# Altium schematic sheet REF_CPU_STM32_A.SchDoc
size A4; SheetNumber: 3; SheetTotal: 8
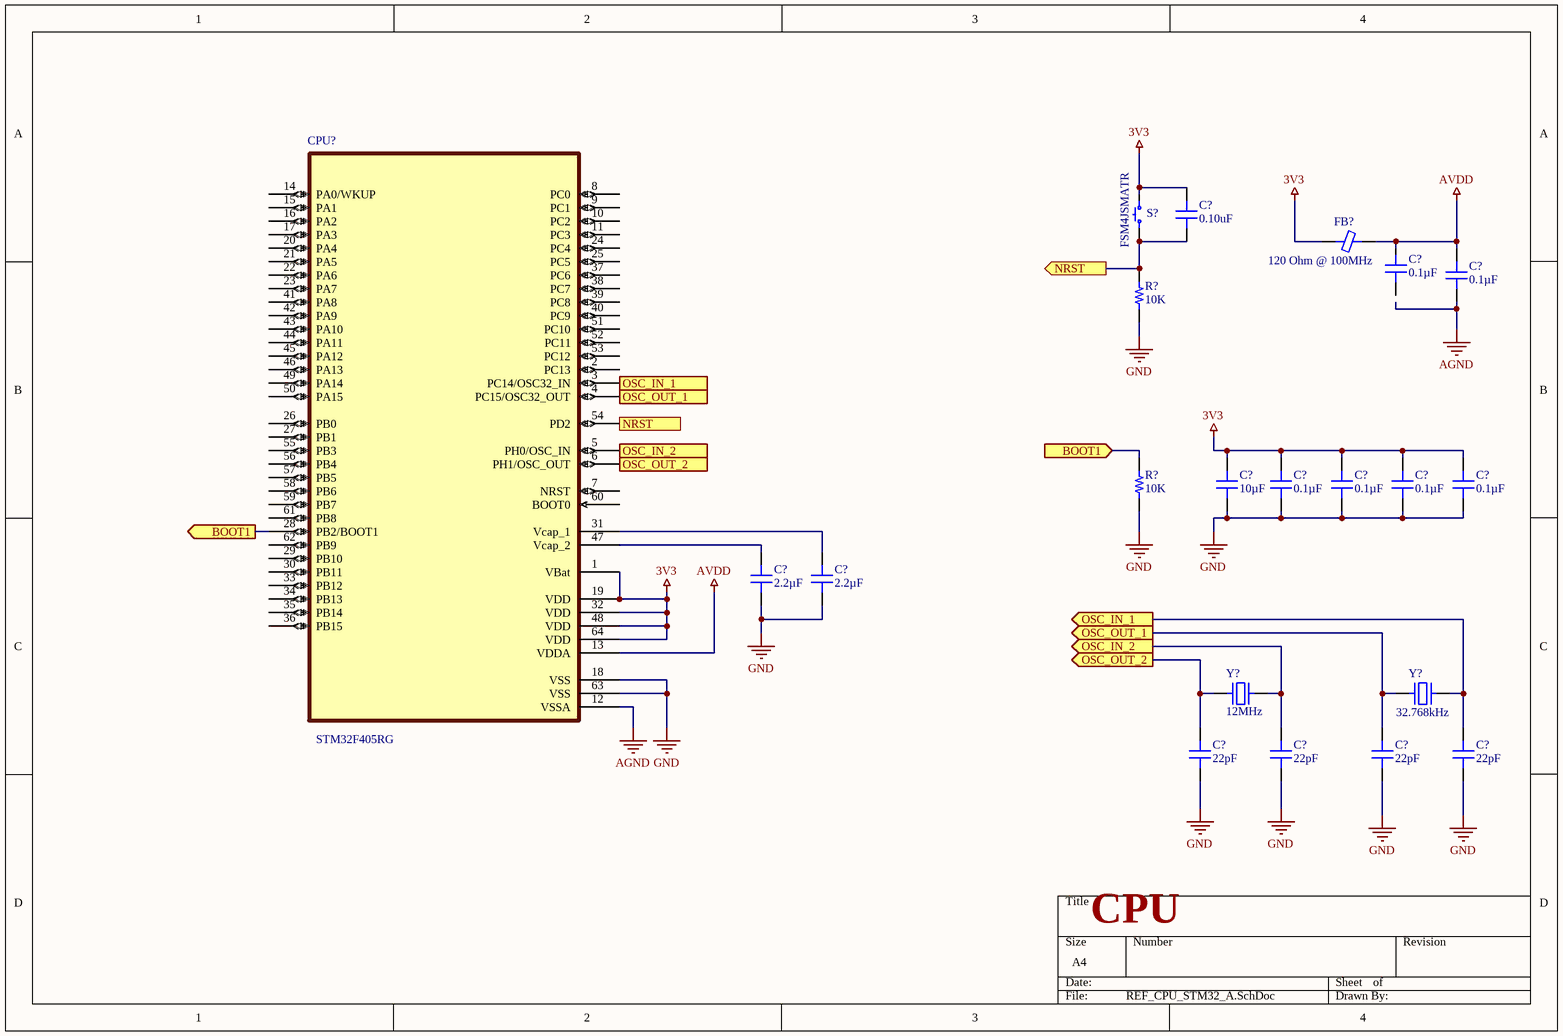
[diagram p0: REF_CPU_STM32_A.SchDoc]

## Parts
(Parts that share a designator on the sheet are numbered #1, #2 ... from top to bottom, then left to right.)
C?#1  0.10uF  [CAP 0603/1608]
C?#2  0.1µF  [CAP 0603_1608]
C?#3  0.1µF  [CAP 0603_1608]
C?#4  10µF  [CAP 0603_1608]
C?#5  0.1µF  [CAP 0603_1608]
C?#6  0.1µF  [CAP 0603_1608]
C?#7  0.1µF  [CAP 0603_1608]
C?#8  0.1µF  [CAP 0603_1608]
C?#9  2.2µF  [CAP 0603_1608]
C?#10  2.2µF  [CAP 0603_1608]
C?#11  22pF  [CAP 0402_1005]
C?#12  22pF  [CAP 0402_1005]
C?#13  22pF  [CAP 0402_1005]
C?#14  22pF  [CAP 0402_1005]
CPU?  STM32F405RG  [LQF64]
FB?  120 Ohm @ 100MHz  [FER 0805/2012]
R?#1  10K  [RES 0603/1608]
R?#2  10K  [RES 0603/1608]
S?  FSM4JSMATR  [TE FSM4JSMA]
Y?#1  12MHz  [ECS CSM-3X]
Y?#2  32.768kHz  [ABRACON ABS25]

## Ports
BOOT1 (in), BOOT1 (out), NRST (out), OSC_IN_1 (out), OSC_IN_2 (out), OSC_OUT_1 (out), OSC_OUT_2 (out)

## Nets
3V3: C?#1.2 C?#4.2 C?#5.2 C?#6.2 C?#7.2 C?#8.2 CPU?.1(VBat) CPU?.19(VDD) CPU?.32(VDD) CPU?.48(VDD) CPU?.64(VDD) FB?.1 S?.1 S?.2
AGND: C?#3.1 CPU?.12(VSSA)
AVDD: C?#2.2 C?#3.2 CPU?.13(VDDA) FB?.2
GND: C?#4.1 C?#5.1 C?#6.1 C?#7.1 C?#8.1 C?#9.1 C?#10.1 C?#11.1 C?#12.2 C?#13.1 C?#14.1 CPU?.18(VSS) CPU?.63(VSS) R?#1.1 R?#2.1
BOOT1: CPU?.28(PB2/BOOT1) R?#2.2 ; port BOOT1
NRST: C?#1.1 CPU?.54(PD2) R?#1.2 S?.3 S?.4 ; port NRST
OSC_IN_1: C?#14.2 CPU?.3(PC14/OSC32_IN) Y?#2.4 ; port OSC_IN_1
OSC_IN_2: C?#12.1 CPU?.5(PH0/OSC_IN) Y?#1.2 ; port OSC_IN_2
OSC_OUT_1: C?#13.2 CPU?.4(PC15/OSC32_OUT) Y?#2.1 ; port OSC_OUT_1
OSC_OUT_2: C?#11.2 CPU?.6(PH1/OSC_OUT) Y?#1.1 ; port OSC_OUT_2
NetC?#9_2: C?#9.2 CPU?.47(Vcap_2)
NetC?#10_2: C?#10.2 CPU?.31(Vcap_1)

Not connected (* = marked no-connect by the designer): C?#2 1; CPU? 2(PC13) 7(NRST) 8(PC0) 9(PC1) 10(PC2) 11(PC3) 14(PA0/WKUP) 15(PA1) 16(PA2) 17(PA3) 20(PA4) 21(PA5) 22(PA6) 23(PA7) 24(PC4) 25(PC5) 26(PB0) 27(PB1) 29(PB10) 30(PB11) 33(PB12) 34(PB13) 35(PB14) 36(PB15) 37(PC6) 38(PC7) 39(PC8) 40(PC9) 41(PA8) 42(PA9) 43(PA10) 44(PA11) 45(PA12) 46(PA13) 49(PA14) 50(PA15) 51(PC10) 52(PC11) 53(PC12) 55(PB3) 56(PB4) 57(PB5) 58(PB6) 59(PB7) 60(BOOT0) 61(PB8) 62(PB9)

## Notes on the sheet
- CPU

## Library data of the parts
C?#1 = CL10B104KB8NNNC: CAP CER 0.1UF 50V X7R 0603; Manufacturer: Samsung Electro-Mechanics America, Inc.; TemperatureRange: -55C ~ 125C; Tolerance: 10%; Value: 0.10uF; Part Number: CL10B104KB8NNNC; PartId: 12945; Supplier 1: Digi-Key; Supplier Part Number 1: 1276-1000-2-ND; ComponentLink1Description: Datasheet; ComponentLink1URL: http://www.samsungsem.com/kr/support/product-search/mlcc/CL10B104KB8NNNC.jsp; ComponentLink2Description: Digi-Key Listing; ComponentLink2URL: https://www.digikey.com/product-detail/en/samsung-electro-mechanics-america-inc/CL10B104KB8NNNC/1276-1000-2-ND/3886658; TemperatureCoefficient: X7R; Voltage: 50V; Price: 0.0052; Device Package: 0603 (1608 Metric)
C?#2 C?#3 C?#5-C?#8 = 06033C104JAT2A: CAP CER 0.1UF 25V X7R 0603; Manufacturer: AVX Corporation; Tolerance: ±5%; Part Number: 06033C104JAT2A; Value: 0.1µF; Applications: General Purpose; Capacitance: 0.1µF; ComponentLink1Description: Datasheet; ComponentLink1URL: http://datasheets.avx.com/X7RDielectric.pdf; ComponentLink2Description: DigiKey Link; ComponentLink2URL: http://digikey.com/product-detail/en/avx-corporation/06033C104JAT2A/478-3713-1-ND/1116411; Device Package: 0603 (1608 Metric); LastUpdated: 9/2/2020 1:03:17 AM; Lifecycle Status: Active; Minimum Order: 1; Mounting Type: Surface Mount, MLCC; Operating Temperature: -55°C ~ 125°C; Package / Case: 0603 (1608 Metric); Packaging: TapeAndReel; PartId: 12698; Part Status: Active; Price: 0.07; Series: -; Size / Dimension: 0.063" L x 0.032" W (1.60mm x 0.81mm); Supplier 1: DigiKey; Supplier Part Number 1: 478-3713-1-ND; Temperature Coefficient: X7R; Thickness (Max): 0.035" (0.90mm); Voltage - Rated: 25V
C?#4 = CL10A106MA8NRNC: CAP CER 10UF 25V X5R 0603; Manufacturer: Samsung Electro-Mechanics; Tolerance: ±20%; Part Number: CL10A106MA8NRNC; Value: 10µF; Applications: General Purpose; Capacitance: 10µF; ComponentLink1Description: Datasheet; ComponentLink1URL: http://www.samsungsem.com/kr/support/product-search/mlcc/CL10A106MA8NRNC.jsp; ComponentLink2Description: DigiKey Link; ComponentLink2URL: http://digikey.com/product-detail/en/samsung-electro-mechanics/CL10A106MA8NRNC/1276-1869-1-ND/3889955; Device Package: 0603 (1608 Metric); LastUpdated: 9/2/2020 1:03:19 AM; Lifecycle Status: Active; Minimum Order: 1; Mounting Type: Surface Mount, MLCC; Operating Temperature: -55°C ~ 85°C; Package / Case: 0603 (1608 Metric); Packaging: TapeAndReel; PartId: 11461; Part Status: Active; Price: 0.18; Series: CL; Size / Dimension: 0.063" L x 0.031" W (1.60mm x 0.80mm); Supplier 1: DigiKey; Supplier Part Number 1: 1276-1869-1-ND; Temperature Coefficient: X5R; Thickness (Max): 0.035" (0.90mm); Voltage - Rated: 25V
C?#9 C?#10 = C1608JB1E225K080AB: CAP CER 2.2UF 25V JB 0603; Manufacturer: TDK Corporation; Tolerance: ±10%; Part Number: C1608JB1E225K080AB; Value: 2.2µF; Applications: General Purpose; Capacitance: 2.2µF; ComponentLink1Description: Datasheet; ComponentLink1URL: https://product.tdk.com/info/en/catalog/datasheets/mlcc_commercial_general_en.pdf?ref_disty=digikey; ComponentLink2Description: DigiKey Link; ComponentLink2URL: http://digikey.com/product-detail/en/tdk-corporation/C1608JB1E225K080AB/445-11245-1-ND/3952911; Device Package: 0603 (1608 Metric); Features: Low ESL; LastUpdated: 9/2/2020 1:03:22 AM; Lifecycle Status: Active; Minimum Order: 1; Mounting Type: Surface Mount, MLCC; Operating Temperature: -25°C ~ 85°C; Package / Case: 0603 (1608 Metric); Packaging: TapeAndReel; PartId: 10303; Part Status: Active; Price: 0.05; Series: C; Size / Dimension: 0.063" L x 0.031" W (1.60mm x 0.80mm); Supplier 1: DigiKey; Supplier Part Number 1: 445-11245-1-ND; Temperature Coefficient: JB; Thickness (Max): 0.035" (0.90mm); Voltage - Rated: 25V
C?#11-C?#14 = 04023A220KAT2A: CAP CER 22PF 25V NP0 0402; Manufacturer: AVX Corporation; Temperature Coefficient: C0G, NP0; Tolerance: ±10%; Part Number: 04023A220KAT2A; Value: 22pF; Applications: General Purpose; Capacitance: 22pF; ComponentLink1Description: Datasheet; ComponentLink1URL: http://datasheets.avx.com/C0GNP0-Dielectric.pdf; ComponentLink2Description: DigiKey Link; ComponentLink2URL: http://digikey.com/product-detail/en/avx-corporation/04023A220KAT2A/478-12611-1-ND/9949149; Device Package: 0402 (1005 Metric); LastUpdated: 9/2/2020 1:02:24 AM; Lifecycle Status: Active; Minimum Order: 1; Mounting Type: Surface Mount, MLCC; Operating Temperature: -55°C ~ 125°C; Package / Case: 0402 (1005 Metric); Packaging: TapeAndReel; PartId: 1976; Part Status: Active; Price: 0.01; Series: -; Size / Dimension: 0.039" L x 0.020" W (1.00mm x 0.50mm); Supplier 1: DigiKey; Supplier Part Number 1: 478-12611-1-ND; Thickness (Max): 0.022" (0.56mm); Voltage - Rated: 25V
CPU? = STM32F405RGT6: CPU
FB? = 1624117-5: FERRITE CHIP 120 OHM 300MA 0805; Manufacturer: TE Connectivity AMP Connectors; Type: Differential Mode - Single; DC Resistance: 300 mOhm Max; Part Number: 1624117-5; PartId: 6827; Value: 120 Ohm @ 100MHz; Supplier 1: Digi-Key; Supplier Part Number 1: A102194TR-ND; ComponentLink1Description: Datasheet; ComponentLink1URL: http://www.te.com/commerce/DocumentDelivery/DDEController?Action=srchrtrv&DocNm=1773178&DocType=DS&DocLang=English; ComponentLink2Description: Digi-Key listing; ComponentLink2URL: http://digikey.com/product-detail/en/1624117-5/A102194TR-ND/2054601; Price: 0.0446; Device Package: 0805 (2012 Metric); Current Rating: 300mA
R?#1 R?#2 = 0603S8J0103: RES SMD 10K OHM 5% 1/8W 0603; Manufacturer: Uniohm; TemperatureRange: -55C ~ 155C; TemperatureCoefficient: 100ppm/C; PowerRating: 0.125W, 1/8W; Value: 10K; Part Number: 0603S8J0103; Tolerance: 5%; Price: 0.0089; Device Package: 1608 (0603 Metric)
S? = FSM4JSMATR: SWITCH TACTILE SPST-NO 0.05A 24V; Manufacturer: TE Connectivity Alcoswitch Switches; Switch Function: Off-Mom; Contact Rating @ Voltage: 0.05A @ 24VDC; Actuator Type: Standard; Actuator Orientation: Top Actuated; Illumination: Non-Illuminated; Operating Force: 160gf; Switch Travel: 0.25mm; Mechanical Life: 100,000 Cycles; Part Number: FSM4JSMATR; PartId: 8249; Supplier 1: Digi-Key; Supplier Part Number 1: 450-1759-2-ND; ComponentLink1Description: Datasheet; ComponentLink1URL: http://www.te.com/commerce/DocumentDelivery/DDEController?Action=srchrtrv&DocNm=2-1437565-7&DocType=Customer+Drawing&DocLang=English; ComponentLink2Description: Digi-Key Listing; ComponentLink2URL: http://www.digikey.com/product-detail/en/FSM4JSMATR/450-1759-2-ND/529675; Price: 0.128; Circuit: SPST-NO; Illumination Voltage: -; Illumination Type, Colour: -; Operating Temperature: -35C ~ 85C
Y?#1 = ECS-120-20-3X-TR: CRYSTAL 12.0000MHZ 20PF SMD; Manufacturer: ECS Inc.; Frequency Stability: 50ppm; Frequency Tolerance: 30ppm; ESR: 60 Ohm; Operating Mode: Fundamental; Part Number: ECS-120-20-3X-TR; PartId: 8636; Supplier 1: Digi-Key; Supplier Part Number 1: XC1770TR-ND; ComponentLink1Description: Datasheet; ComponentLink1URL: http://www.ecsxtal.com/store/pdf/CSM-3X.pdf; ComponentLink2Description: Digi-Key Listing; ComponentLink2URL: https://www.digikey.com/product-detail/en/ECS-120-20-3X-TR/XC1770TR-ND/2676600; Price: 0.189; Type: MHz Crystal; Device Package: HC49/US; Series: CSM-3X; Frequency: 12MHz; Load Capacitance: 20pF
Y?#2 = ABS25-32.768KHZ-T: CRYSTAL 32.7680KHZ 12.5PF SMD; Manufacturer: Abracon LLC; Frequency Tolerance: 20ppm; ESR: 50 kOhm; Operating Mode: Fundamental; Part Number: ABS25-32.768KHZ-T; PartId: 8457; Supplier 1: Digi-Key; Supplier Part Number 1: 535-9166-2-ND; ComponentLink1Description: Datasheet; ComponentLink1URL: http://www.abracon.com/Resonators/abs25.pdf; ComponentLink2Description: Digi-Key Listing; ComponentLink2URL: http://www.digikey.com/product-detail/en/ABS25-32.768KHZ-T/535-9166-2-ND/675361; Price: 0.18; Type: kHz Crystal (Tuning Fork); Device Package: 4-SOJ, 5.50mm pitch; Frequency: 32.768kHz; Frequency Stability: -; Load Capacitance: 12.5pF